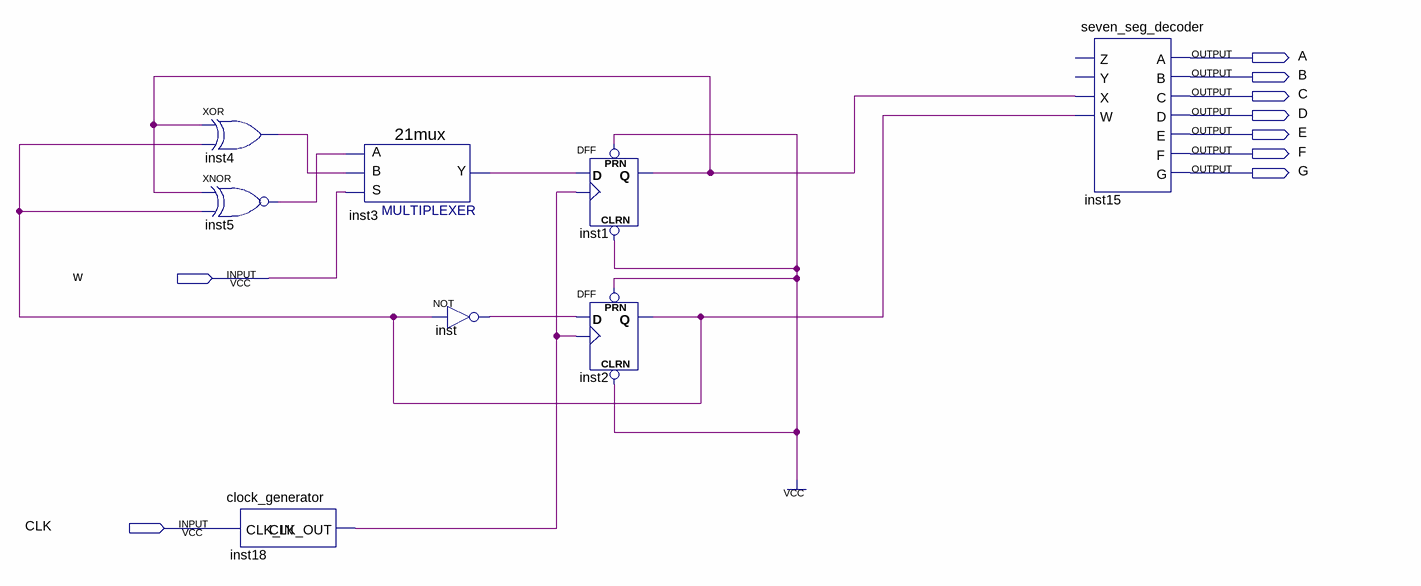
[diagram p0: schematic sheet]
// Quartus schematic lab11step3.bdf as structural Verilog: 8 symbols, 9 pins
module lab11step3 (
  input  w,
  input  CLK,
  output A,
  output B,
  output C,
  output D,
  output E,
  output F,
  output G
);

  wire inst1_q, inst2_q, inst3_y, inst4_out, inst5_out, inst18_clk_out, inst_out;

  xor inst4 (inst4_out, inst1_q, inst2_q);
  xnor inst5 (inst5_out, inst1_q, inst2_q);
  clock_generator inst18 (.CLK_IN(CLK), .CLK_OUT(inst18_clk_out));
  \21mux  inst3 (.S(w), .B(inst4_out), .A(inst5_out), .Y(inst3_y));
  not inst (inst_out, inst2_q);
  DFF inst1 (.CLRN(1'b1), .CLK(inst18_clk_out), .D(inst3_y), .PRN(1'b1), .Q(inst1_q));
  DFF inst2 (.CLRN(1'b1), .CLK(inst18_clk_out), .D(inst_out), .PRN(1'b1), .Q(inst2_q));
  seven_seg_decoder inst15 (.X(inst1_q), .W(inst2_q), .A(A), .B(B), .C(C), .D(D), .E(E), .F(F), .G(G));  // open: Z, Y
endmodule
